# EAGLE design ProcessorPrototype (EAGLE 6.5.0)
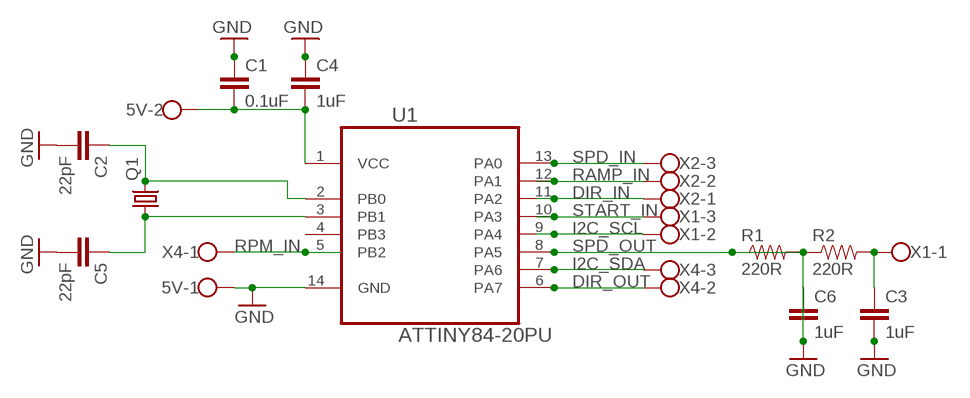
[diagram p0: schematic, sheet 1]

## Parts
5V  W237-102  [W237-102]
C1  0.1uF  CAPPTH1  [CAP-PTH-5MM]
C2  22pF  CAPPTH1  [CAP-PTH-5MM]
C3  1uF  CAPPTH1  [CAP-PTH-5MM]
C4  1uF  CAPPTH1  [CAP-PTH-5MM]
C5  22pF  CAPPTH1  [CAP-PTH-5MM]
C6  1uF  CAPPTH1  [CAP-PTH-5MM]
Q1  CRYSTALHC18U-V  [HC18U-V]
R1  220R  RESISTORAXIAL-0.3  [AXIAL-0.3]
R2  220R  RESISTORAXIAL-0.3  [AXIAL-0.3]
U1  ATTINY84-20PU  [DIP254P762X533-14]
X1  W237-103  [W237-103]
X2  W237-103  [W237-103]
X4  W237-103  [W237-103]

## Nets
DIR_IN: U1.11(PA2) X2.1
DIR_OUT: U1.6(PA7) X4.2
GND: 5V.1 C1.1 C2.2 C3.2 C4.1 C5.2 C6.1 U1.14(GND)
I2C_SCL: U1.9(PA4) X1.2
I2C_SDA: U1.7(PA6) X4.3
N$1: C6.2 R1.P$1 R2.P$1
N$2: C3.1 R2.P$2 X1.1
N$3 [power]: 5V.2 C1.2 C4.2 U1.1(VCC)
N$4: C5.1 Q1.1 U1.3(PB1)
N$5: C2.1 Q1.2 U1.2(PB0)
RAMP_IN: U1.12(PA1) X2.2
RPM_IN: U1.5(PB2) X4.1
SPD_IN: U1.13(PA0) X2.3
SPD_OUT: R1.P$2 U1.8(PA5)
START_IN: U1.10(PA3) X1.3
Unconnected: U1.4(PB3)

## Library data of the parts
5V = con-wago-500:W237-102: WAGO SCREW CLAMP; MPN: 237-102; OC_FARNELL: unknown; OC_NEWARK: 70K9898
C1-C6 = SparkFun-Capacitors:CAP: Capacitor Standard 0603 ceramic capacitor, and 0.1" leaded capacitor.
Q1 = crystal:CRYSTAL: CRYSTAL; OC_FARNELL: unknown; OC_NEWARK: unknown
R1 R2 = SparkFun-Resistors:RESISTOR: Resistor Basic schematic elements and footprints for 0603, 1206, and PTH resistors.
U1 = Atmel_By_element14_Batch_1:ATTINY84-20PU: 8-bit Microcontroller with In-System Programmable Flash; MPN: ATTINY84-20PU; OC_FARNELL: -; OC_NEWARK: 58M3794; PACKAGE: PDIP-14; SUPPLIER: Atmel
X1 X2 X4 = con-wago-500:W237-103: WAGO SCREW CLAMP; MPN: 237-103; OC_FARNELL: unknown; OC_NEWARK: 18M7116

## Net classes
1 power: width 0.381 mm

## Board
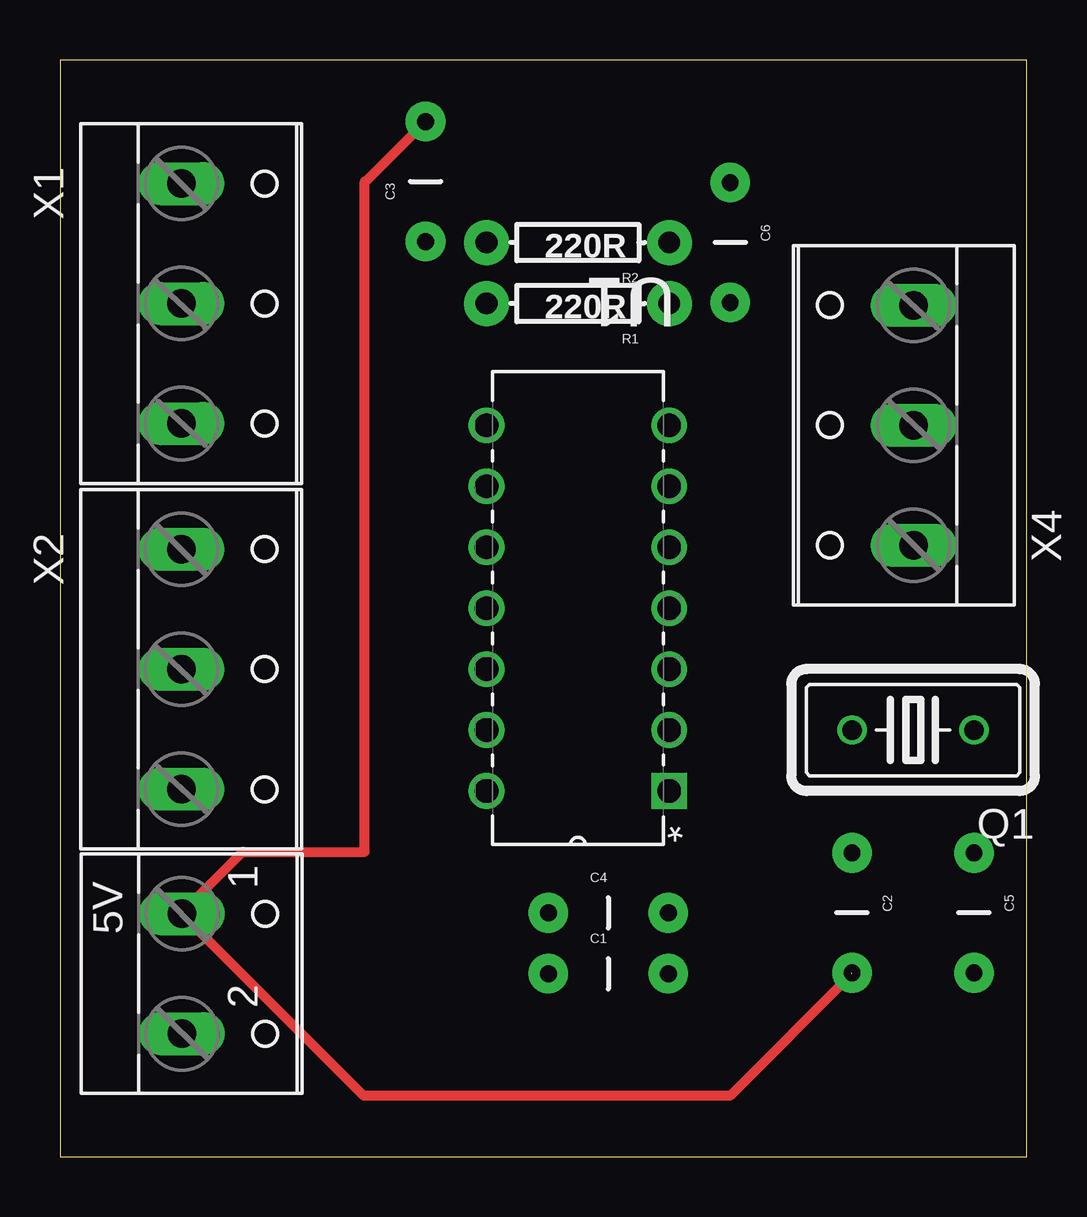
[diagram p1: board, top side]
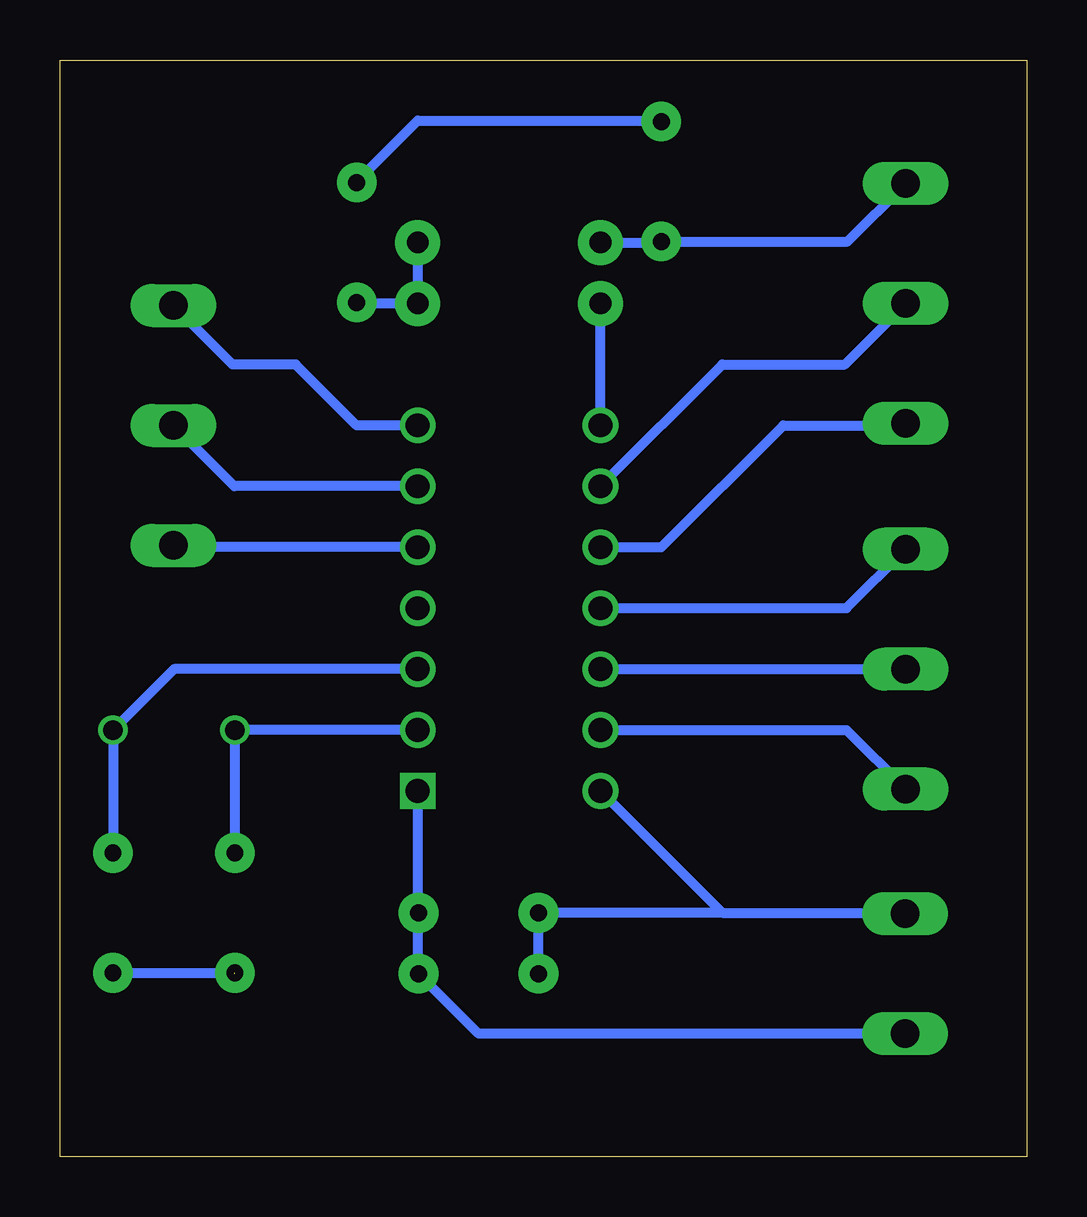
[diagram p2: board, bottom side, seen from below]

Size 40.31 x 45.71 mm. Coordinates in mm from the lower left corner, seen from the top.
Outline: 0,0 40.31,0 40.31,45.71 0,45.71 0,0
Copper layers (1*16): Top 0.0356mm / dielectric 1.5011mm / Bottom 0.0356mm
Design rules "DesignRules": minimum track width 10mil, minimum drill 13mil, track to track 6mil, track to pad 6mil, pad to pad 6mil, via to via 6mil, smd to smd 6mil, copper to edge 15mil, drill to drill 6mil, minimum pad ring 7mil, minimum via ring 7mil, stop-mask expansion 3mil, vias tented up to drill 0mil, thermal gap 10mil

### Footprints (pad centres in the part's own frame; a part is rotated, then mirrored left to right if it is on the bottom)
W237-102 = drill 1.194 long: 1 -2.5,-1.27; 2 2.5,-1.27
CAP-PTH-5MM = drill 0.7 pad 1.651: 1 -2.5,0; 2 2.5,0
HC18U-V = drill 0.813: 1 -2.54,0; 2 2.54,0
AXIAL-0.3 = drill 0.9 pad 1.88: P$1 -3.81,0; P$2 3.81,0
DIP254P762X533-14 = drill 0.991 square: 1 -7.62,15.24 | drill 0.991: 2 -7.62,12.7; 3 -7.62,10.16; 4 -7.62,7.62; 5 -7.62,5.08; 6 -7.62,2.54; 7 -7.62,0; 8 0,0; 9 0,2.54; 10 0,5.08; 11 0,7.62; 12 0,10.16; 13 0,12.7; 14 0,15.24
W237-103 = drill 1.194 long: 1 -5,-1.29; 2 0,-1.29; 3 5,-1.29

### Placement (x,y rotation side)
5V  6.35,7.62 270 top
C1  22.86,7.62 0 top
C2  33.02,10.16 270 top
C3  15.24,40.64 90 top
C4  22.86,10.16 0 top
C5  38.1,10.16 270 top
C6  27.94,38.1 270 top
Q1  35.56,17.78 180 top
R1  21.59,35.56 180 top
R2  21.59,38.1 180 top
U1  17.78,30.48 180 top
X1  6.35,35.56 270 top
X2  6.35,20.32 270 top
X4  34.29,30.48 90 top

### Tracks (layer width: path | path; a pad name or v marks a point on that pad's centre or on a via)
DIR_IN
  Bottom 0.406: U1.11 7.52,22.86 X2.1
DIR_OUT
  Bottom 0.406: U1.6 33.04,27.94 X4.2
GND  (1 unrouted)
  Top 0.406: C3.2 12.74,40.64 12.7,40.64 12.7,12.7 7.62,12.7 5.08,10.16 5V.1 12.66,2.54 27.94,2.54 33.02,7.62
  Bottom 0.406: 15.2,43.14 C3.2 15.28,43.18 25.4,43.18 27.94,40.64 C6.1 | U1.14 12.7,10.16 | 12.7,10.16 5.12,10.16 5V.1 | 12.7,10.16 C4.1 C1.1 | C5.2 C2.2
I2C_SCL
  Bottom 0.406: U1.9 12.7,33.02 7.6,33.02 X1.2
I2C_SDA
  Bottom 0.406: U1.7 27.94,30.48 30.48,33.02 33.12,33.02 X4.3
N$1
  Bottom 0.406: C6.2 27.9,35.56 R1.P$1 R2.P$1
N$2
  Bottom 0.406: X1.1 7.48,38.14 C3.1 15.28,38.1 R2.P$2
N$3
  Bottom 0.406: 5V.2 22.86,5.12 C1.2 25.4,7.66 25.4,10.16 C4.2 25.4,10.2 U1.1
N$4
  Bottom 0.406: U1.3 35.56,20.32 Q1.1 C5.1
N$5
  Bottom 0.406: C2.1 Q1.2 U1.2
RAMP_IN
  Bottom 0.406: U1.12 X2.2
RPM_IN
  Bottom 0.406: U1.5 35.5,25.4 X4.1
SPD_IN
  Bottom 0.406: U1.13 7.52,17.78 X2.3
SPD_OUT
  Bottom 0.406: U1.8 R1.P$2
START_IN
  Bottom 0.406: U1.10 15.24,25.4 10.16,30.48 5.14,30.48 X1.3